# Altium schematic sheet Main.SchDoc
size Letter
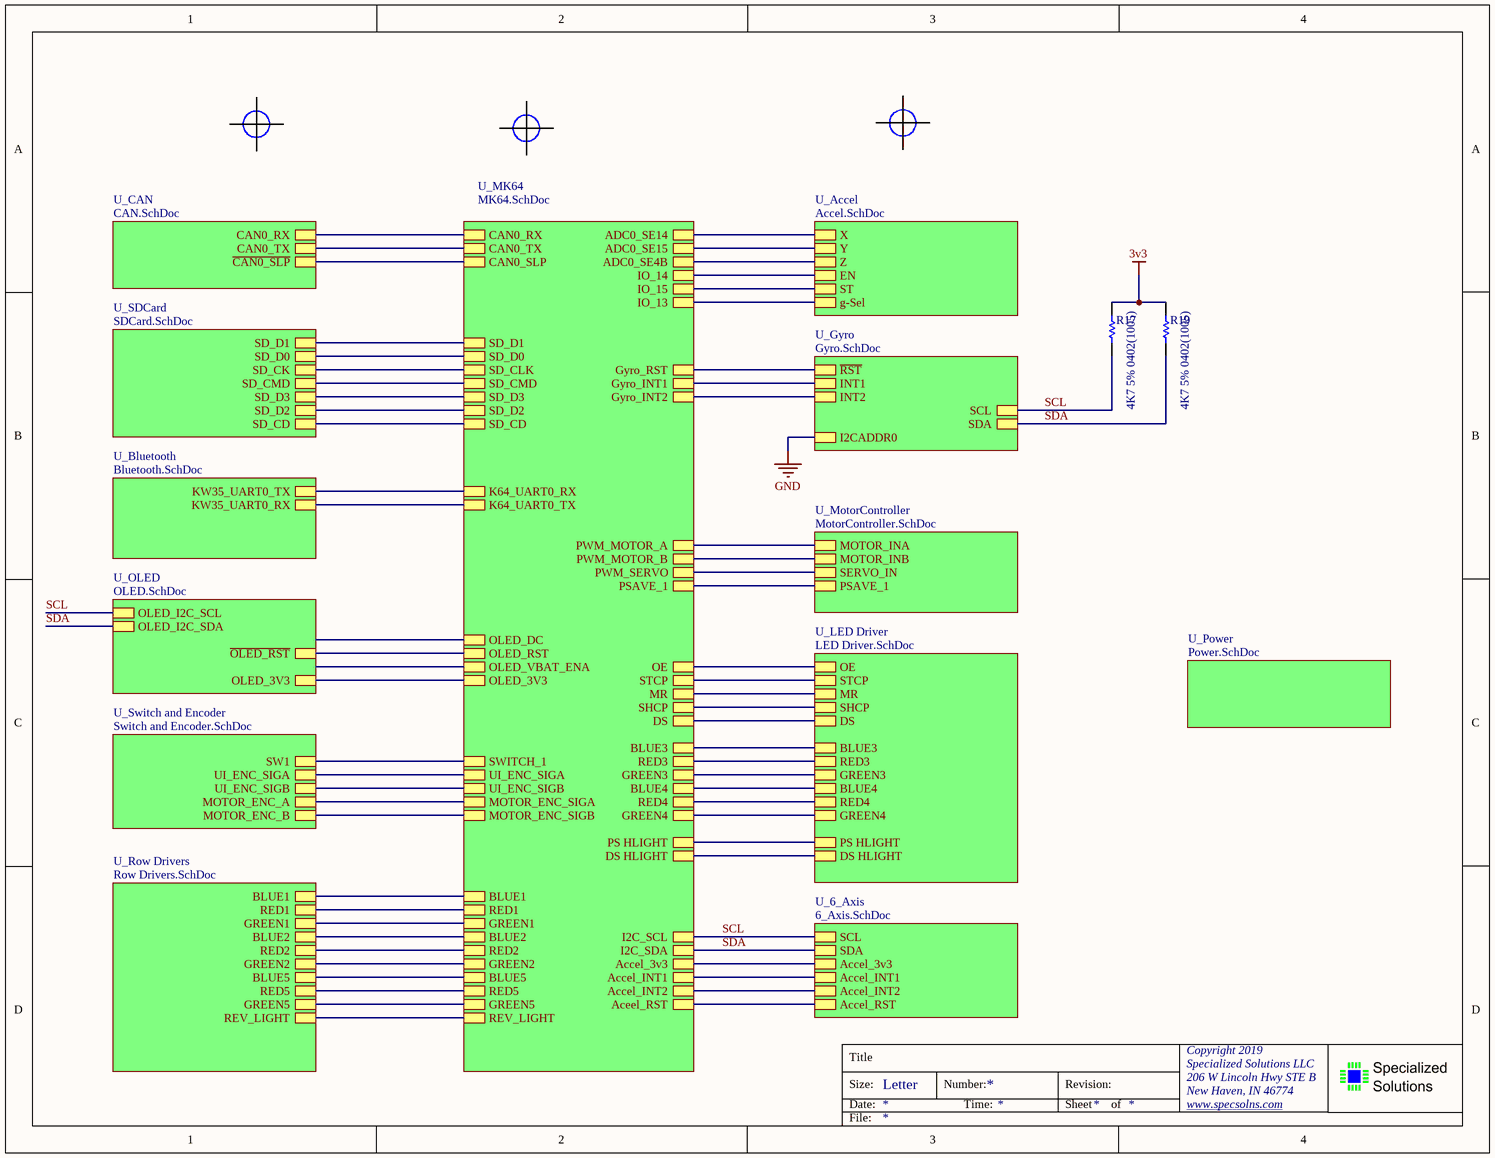
[diagram p0: Main.SchDoc]

## Parts
(Parts that share a designator on the sheet are numbered #1, #2 ... from top to bottom, then left to right.)
?#1  Fiducial (Cross)  [Fiducial - Cross]  (value not drawn)  (no BOM)
?#2  Fiducial (Cross)  [Fiducial - Cross]  (value not drawn)  (no BOM)
?#3  Fiducial (Cross)  [Fiducial - Cross]  (value not drawn)  (no BOM)
R17  4K7 5% 0402(1005)  [RESC0402(1005)_L]
R19  4K7 5% 0402(1005)  [RESC0402(1005)_L]

## Sub-sheets
U_6_Axis = 6_Axis.SchDoc: Accel_3v3, SCL, SDA, Accel_INT1, Accel_INT2, Accel_RST
U_Accel = Accel.SchDoc: g-Sel, X, Y, Z, EN, ST
U_Bluetooth = Bluetooth.SchDoc: KW35_UART0_RX, KW35_UART0_TX
U_CAN = CAN.SchDoc: ~{CAN0_SLP}, CAN0_TX, CAN0_RX
U_Gyro = Gyro.SchDoc: ~{RST}, INT1, INT2, SCL, SDA, I2CADDR0
U_LED Driver = LED Driver.SchDoc: OE, STCP, MR, SHCP, DS, BLUE3, RED3, GREEN3, BLUE4, RED4, GREEN4, PS HLIGHT, DS HLIGHT
U_MK64 = MK64.SchDoc: CAN0_RX, CAN0_TX, CAN0_SLP, SD_D1, SD_D0, SD_CLK, SD_CMD, SD_D3, SD_D2, SD_CD, OLED_RST, OLED_DC, OLED_VBAT_ENA, OLED_3V3, I2C_SDA, I2C_SCL, Gyro_RST, Gyro_INT1, Gyro_INT2, PWM_MOTOR_A, PWM_MOTOR_B, PWM_SERVO, UI_ENC_SIGA, UI_ENC_SIGB, MOTOR_ENC_SIGA, MOTOR_ENC_SIGB, IO_13, IO_15, IO_14, OE, STCP, MR, SHCP, DS, RED1, GREEN1, BLUE1, BLUE3, RED2, BLUE2, GREEN3, RED3, GREEN2, GREEN4, RED4, BLUE4, PSAVE_1, SWITCH_1, PS HLIGHT, DS HLIGHT, K64_UART0_TX, K64_UART0_RX, ADC0_SE14, ADC0_SE15, ADC0_SE4B, BLUE5, RED5, GREEN5, REV_LIGHT, Aceel_RST, Accel_INT2, Accel_3v3, Accel_INT1
U_MotorController = MotorController.SchDoc: MOTOR_INA, MOTOR_INB, SERVO_IN, PSAVE_1
U_OLED = OLED.SchDoc: OLED_I2C_SCL, OLED_I2C_SDA, ~{OLED_RST}, OLED_3V3
U_Power = Power.SchDoc: no entries
U_Row Drivers = Row Drivers.SchDoc: BLUE1, RED1, GREEN1, BLUE2, RED2, GREEN2, REV_LIGHT, RED5, BLUE5, GREEN5
U_SDCard = SDCard.SchDoc: SD_D2, SD_D3, SD_CK, SD_D1, SD_D0, SD_CMD, SD_CD
U_Switch and Encoder = Switch and Encoder.SchDoc: UI_ENC_SIGA, UI_ENC_SIGB, MOTOR_ENC_A, MOTOR_ENC_B, SW1

## Nets
3v3: R17.2 R19.2
GND: sheet U_Gyro/I2CADDR0
SCL: R17.1 ; sheet U_Gyro/SCL, sheet U_OLED/OLED_I2C_SCL, sheet U_MK64/I2C_SCL, sheet U_6_Axis/SCL
SDA: R19.1 ; sheet U_Gyro/SDA, sheet U_OLED/OLED_I2C_SDA, sheet U_MK64/I2C_SDA, sheet U_6_Axis/SDA
(unnamed): sheet U_Gyro/~{RST}, sheet U_MK64/Gyro_RST
(unnamed): sheet U_Gyro/INT1, sheet U_MK64/Gyro_INT1
(unnamed): sheet U_Gyro/INT2, sheet U_MK64/Gyro_INT2
(unnamed): sheet U_MotorController/MOTOR_INA, sheet U_MK64/PWM_MOTOR_A
(unnamed): sheet U_MotorController/MOTOR_INB, sheet U_MK64/PWM_MOTOR_B
(unnamed): sheet U_MotorController/SERVO_IN, sheet U_MK64/PWM_SERVO
(unnamed): sheet U_MotorController/PSAVE_1, sheet U_MK64/PSAVE_1
(unnamed): sheet U_OLED/~{OLED_RST}, sheet U_MK64/OLED_RST
(unnamed): sheet U_OLED/OLED_3V3, sheet U_MK64/OLED_3V3
(unnamed): sheet U_SDCard/SD_D2, sheet U_MK64/SD_D2
(unnamed): sheet U_SDCard/SD_D3, sheet U_MK64/SD_D3
(unnamed): sheet U_SDCard/SD_CK, sheet U_MK64/SD_CLK
(unnamed): sheet U_SDCard/SD_D1, sheet U_MK64/SD_D1
(unnamed): sheet U_SDCard/SD_D0, sheet U_MK64/SD_D0
(unnamed): sheet U_SDCard/SD_CMD, sheet U_MK64/SD_CMD
(unnamed): sheet U_SDCard/SD_CD, sheet U_MK64/SD_CD
(unnamed): sheet U_CAN/~{CAN0_SLP}, sheet U_MK64/CAN0_SLP
(unnamed): sheet U_CAN/CAN0_TX, sheet U_MK64/CAN0_TX
(unnamed): sheet U_CAN/CAN0_RX, sheet U_MK64/CAN0_RX
(unnamed): sheet U_Bluetooth/KW35_UART0_RX, sheet U_MK64/K64_UART0_TX
(unnamed): sheet U_Bluetooth/KW35_UART0_TX, sheet U_MK64/K64_UART0_RX
(unnamed): sheet U_LED Driver/OE, sheet U_MK64/OE
(unnamed): sheet U_LED Driver/STCP, sheet U_MK64/STCP
(unnamed): sheet U_LED Driver/MR, sheet U_MK64/MR
(unnamed): sheet U_LED Driver/SHCP, sheet U_MK64/SHCP
(unnamed): sheet U_LED Driver/DS, sheet U_MK64/DS
(unnamed): sheet U_LED Driver/BLUE3, sheet U_MK64/BLUE3
(unnamed): sheet U_LED Driver/RED3, sheet U_MK64/RED3
(unnamed): sheet U_LED Driver/GREEN3, sheet U_MK64/GREEN3
(unnamed): sheet U_LED Driver/BLUE4, sheet U_MK64/BLUE4
(unnamed): sheet U_LED Driver/RED4, sheet U_MK64/RED4
(unnamed): sheet U_LED Driver/GREEN4, sheet U_MK64/GREEN4
(unnamed): sheet U_LED Driver/PS HLIGHT, sheet U_MK64/PS HLIGHT
(unnamed): sheet U_LED Driver/DS HLIGHT, sheet U_MK64/DS HLIGHT
(unnamed): sheet U_MK64/UI_ENC_SIGA, sheet U_Switch and Encoder/UI_ENC_SIGA
(unnamed): sheet U_MK64/UI_ENC_SIGB, sheet U_Switch and Encoder/UI_ENC_SIGB
(unnamed): sheet U_MK64/MOTOR_ENC_SIGA, sheet U_Switch and Encoder/MOTOR_ENC_A
(unnamed): sheet U_MK64/MOTOR_ENC_SIGB, sheet U_Switch and Encoder/MOTOR_ENC_B
(unnamed): sheet U_MK64/IO_13, sheet U_Accel/g-Sel
(unnamed): sheet U_MK64/IO_15, sheet U_Accel/ST
(unnamed): sheet U_MK64/IO_14, sheet U_Accel/EN
(unnamed): sheet U_MK64/RED1, sheet U_Row Drivers/RED1
(unnamed): sheet U_MK64/GREEN1, sheet U_Row Drivers/GREEN1
(unnamed): sheet U_MK64/BLUE1, sheet U_Row Drivers/BLUE1
(unnamed): sheet U_MK64/RED2, sheet U_Row Drivers/RED2
(unnamed): sheet U_MK64/BLUE2, sheet U_Row Drivers/BLUE2
(unnamed): sheet U_MK64/GREEN2, sheet U_Row Drivers/GREEN2
(unnamed): sheet U_MK64/SWITCH_1, sheet U_Switch and Encoder/SW1
(unnamed): sheet U_MK64/ADC0_SE14, sheet U_Accel/X
(unnamed): sheet U_MK64/ADC0_SE15, sheet U_Accel/Y
(unnamed): sheet U_MK64/ADC0_SE4B, sheet U_Accel/Z
(unnamed): sheet U_MK64/BLUE5, sheet U_Row Drivers/BLUE5
(unnamed): sheet U_MK64/RED5, sheet U_Row Drivers/RED5
(unnamed): sheet U_MK64/GREEN5, sheet U_Row Drivers/GREEN5
(unnamed): sheet U_MK64/REV_LIGHT, sheet U_Row Drivers/REV_LIGHT
(unnamed): sheet U_MK64/Aceel_RST, sheet U_6_Axis/Accel_RST
(unnamed): sheet U_MK64/Accel_INT2, sheet U_6_Axis/Accel_INT2
(unnamed): sheet U_MK64/Accel_3v3, sheet U_6_Axis/Accel_3v3
(unnamed): sheet U_MK64/Accel_INT1, sheet U_6_Axis/Accel_INT1

Not connected (* = marked no-connect by the designer): ?#1 0; ?#2 0; ?#3 0

## Notes on the sheet
- Title
- Size:
- Date:
- Letter
- Number:
- Time:
- Revision:
- Sheet
- of
- Copyright 2019
- Specialized Solutions LLC
- 206 W Lincoln Hwy STE B
- New Haven, IN 46774
- www.specsolns.com <http://www.specsolns.com>
- File:

## Library data of the parts
?#1-?#3 = Fiducial - Cross
R17 R19 = CMP-1011-00090-1: 4K7 0.063W 5% 0402 (1005 Metric)  SMD; Value: 4700.00 Ohm; Case-EIA: 0402; Case-Metric: 1005; Tolerance: 5 %; Power: 0.063 W; Technology: SMT